# EAGLE schematic rotencoder (EAGLE 6.4)
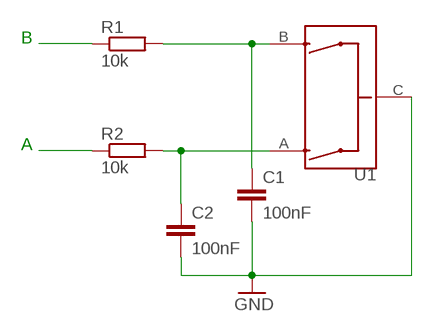
[diagram p0: schematic, sheet 1]

## Parts
C1  100nF  C-EU025-040X050  [C025-040X050]
C2  100nF  C-EU025-040X050  [C025-040X050]
R1  10k  R-EU_0309/12  [0309/12]
R2  10k  R-EU_0309/12  [0309/12]
U1  ENCODER-QUADRATURE  [ENCODER-16MM-QUAD]

## Nets
GND: C1.2 C2.2 U1.C
N$1: C1.1 R1.2 U1.B
N$2: C2.1 R2.2 U1.A
N$5: R2.1
N$6: R1.1

## Notes on the sheet
- B
- A

## Library data of the parts
C1 C2 = rcl:C-EU: CAPACITOR, European symbol
R1 R2 = rcl:R-EU_: RESISTOR, European symbol
U1 = SparkFun-Electromechanical:ENCODER-QUADRATURE: quadrature encoder from Top-Up, part#EC16PHBF-B-20F-24-24C-16Y